# Altium schematic sheet MOTORS ENCODERS.SchDoc: MOTORS & ENCODERS
size 558 x 401 mm; Organization: Carnegie Institution of Washington; DocumentNumber: 6; SheetNumber: 5; SheetTotal: 7; PageSetup: Record=PageOptions|CenterHorizontal=True|CenterVertical=True|PrintScale=0.47|XCorrection=1.00|YCorrection=1.00|PrintKind=0|BorderSize=5000000|LeftOffset=0|BottomOffset=0|Orientation=2|PaperLength=1000|PaperWidth=1000|Scale=100|PaperSource=259|PrintQuality=600|MediaType=1|DitherType=10|PaperKind=11 x 17|PrintScaleMode=1
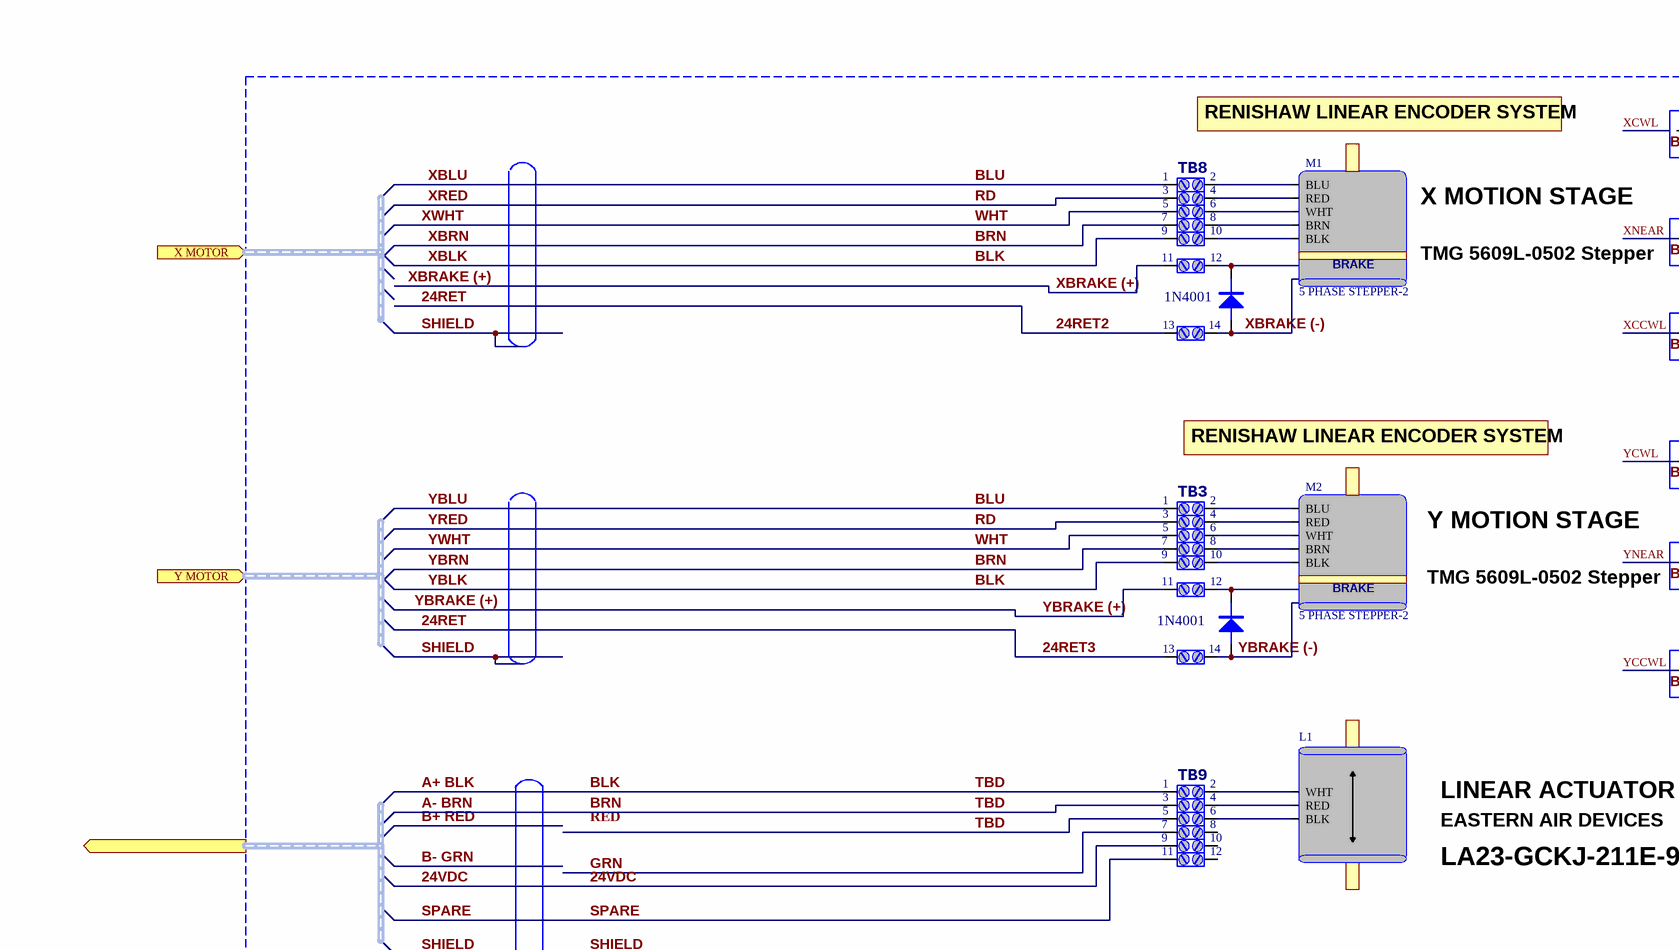
[diagram p0: MOTORS ENCODERS.SchDoc, top left]
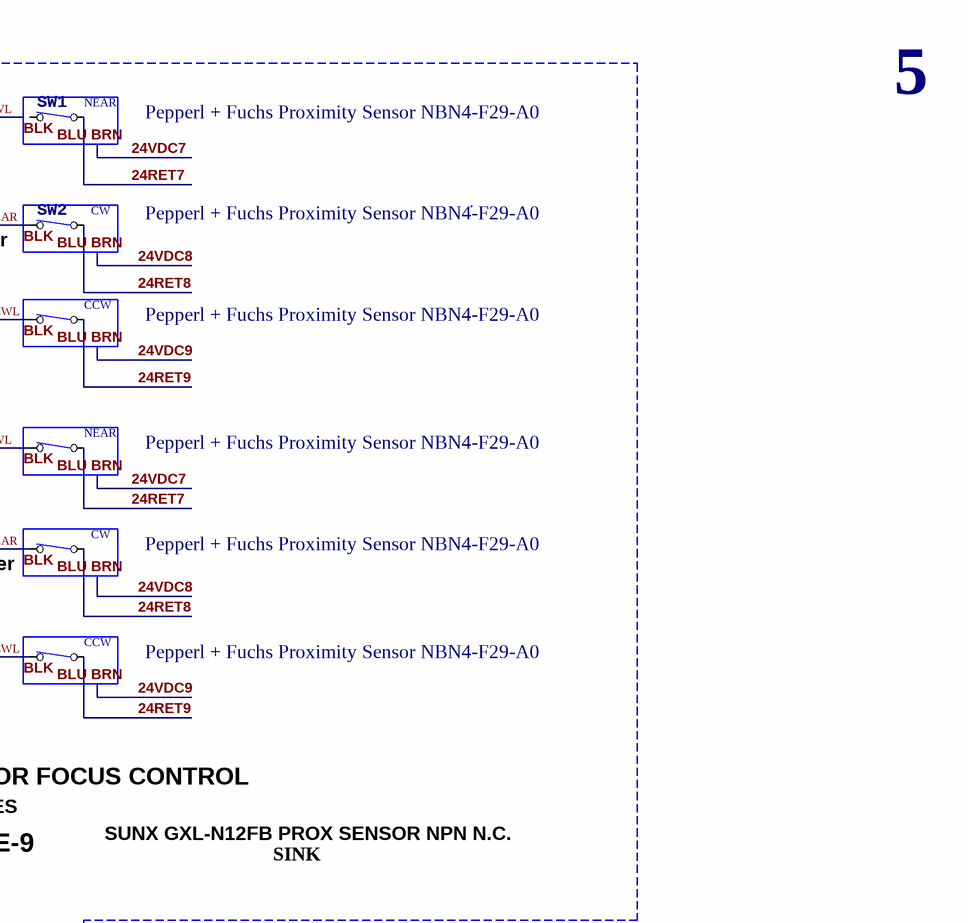
[diagram p1: MOTORS ENCODERS.SchDoc, top right]
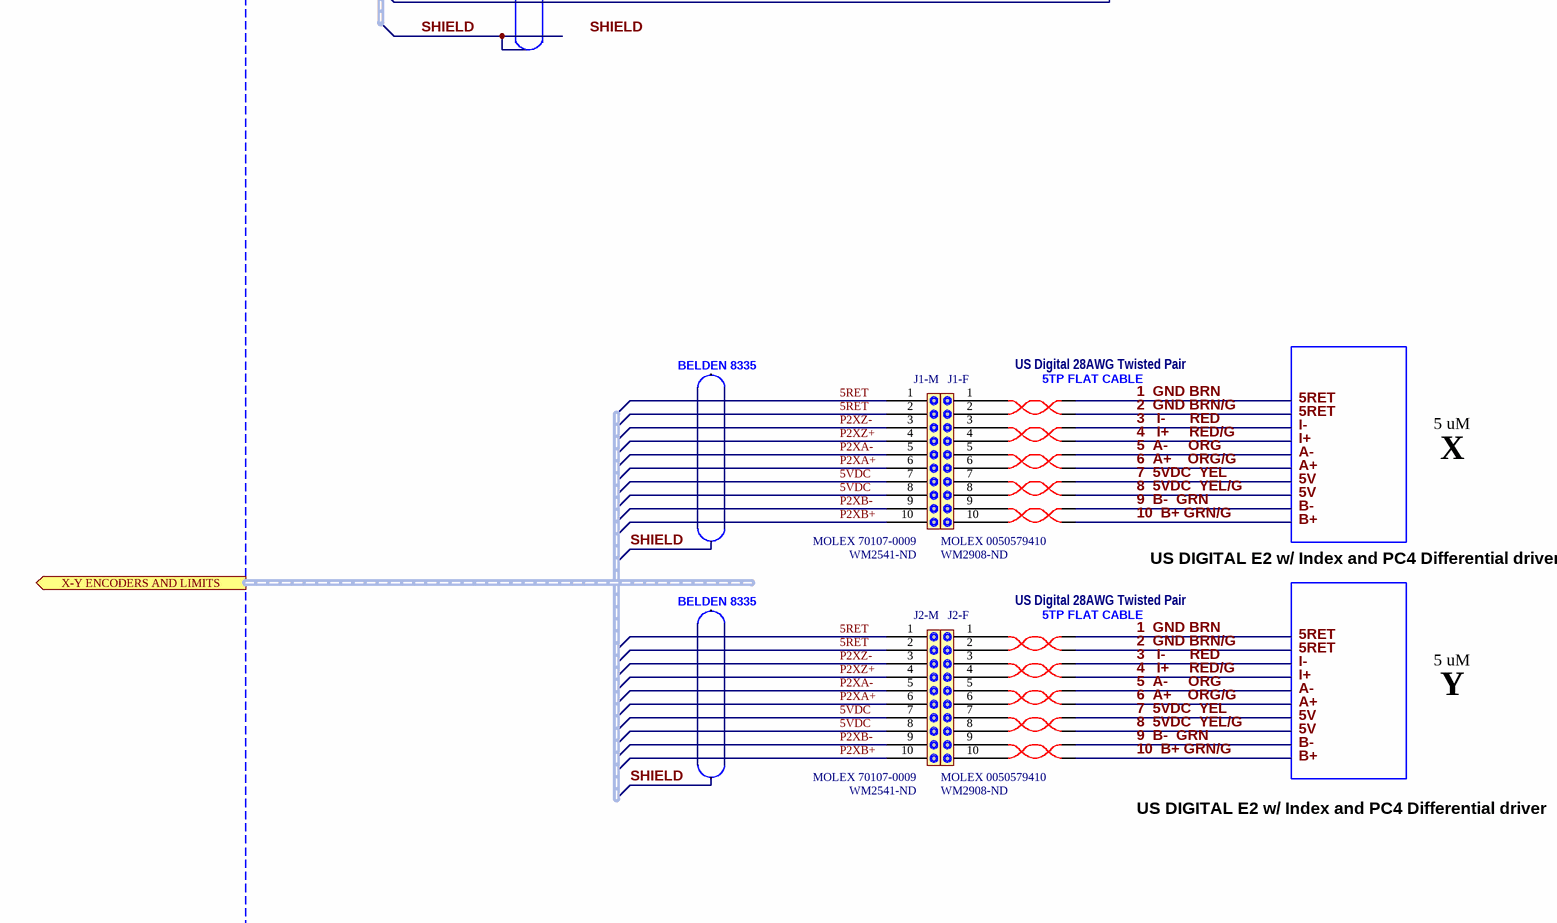
[diagram p2: MOTORS ENCODERS.SchDoc, bottom left]

## Parts
(Parts that share a designator on the sheet are numbered #1, #2 ... from top to bottom, then left to right.)
?#1  Part Field 1: 3  Part Field 2: 4
?#2  Part Field 1: 5  Part Field 2: 6
?#3  Part Field 1: 7  Part Field 2: 8
?#4  Part Field 1: 9  Part Field 2: 10
?#5  Part Field 1: 11  Part Field 2: 12
?#6  (no value)
?#7  Part Field 1: 13  Part Field 2: 14
?#8  (no value)
?#9  (no value)
?#10  Part Field 1: 3  Part Field 2: 4
?#11  Part Field 1: 5  Part Field 2: 6
?#12  Part Field 1: 7  Part Field 2: 8
?#13  Part Field 1: 9  Part Field 2: 10
?#14  (no value)
?#15  Part Field 1: 11  Part Field 2: 12
?#16  (no value)
?#17  Part Field 1: 13  Part Field 2: 14
?#18  (no value)
?#19  Part Field 1: 3  Part Field 2: 4
?#20  Part Field 1: 5  Part Field 2: 6
?#21  Part Field 1: 7  Part Field 2: 8
?#22  Part Field 1: 9  Part Field 2: 10
?#23  Part Field 1: 11  Part Field 2: 12
?#24  (no value)
?#25  TP1  (value not drawn)
?#26  TP1  (value not drawn)
?#27  TP1  (value not drawn)
?#28  TP1  (value not drawn)
?#29  TP1  (value not drawn)
?#30  (no value)
?#31  (no value)
?#32  TP1  (value not drawn)
?#33  TP1  (value not drawn)
?#34  TP1  (value not drawn)
?#35  TP1  (value not drawn)
?#36  TP1  (value not drawn)
?#37  (no value)
J1-F  MOLEX 0050579410  Digikey: WM2908-ND
J1-M  MOLEX 70107-0009  Digikey: WM2541-ND
J2-F  MOLEX 0050579410  Digikey: WM2908-ND
J2-M  MOLEX 70107-0009  Digikey: WM2541-ND
L1  LINEAR MOTOR  (value not drawn)
M1  5 PHASE STEPPER-2
M2  5 PHASE STEPPER-2
SW1  (no value)
SW2  (no value)
TB3  Part Field 1: 1  Part Field 2: 2
TB8  Part Field 1: 1  Part Field 2: 2
TB9  Part Field 1: 1  Part Field 2: 2

## Blocks framed on the sheet
NEAR: SW1
CW: SW2
CCW: ?#8
NEAR: ?#9
CW: ?#14
CCW: ?#18

## Ports
X MOTOR, X-Y ENCODERS AND LIMITS, Y MOTOR, 

## Nets
1  GND BRN: ?#25.18 ?#32.18
2  GND BRN/G: ?#25.17 ?#32.17
3   I-      RED: ?#26.18 ?#33.18
4   I+     RED/G: ?#26.17 ?#33.17
5  A-     ORG: ?#27.18 ?#34.18
5RET: J1-M.1 J1-M.2 J2-M.1 J2-M.2
5VDC: J1-M.7 J1-M.8 J2-M.7 J2-M.8
6  A+    ORG/G: ?#27.17 ?#34.17
7  5VDC  YEL : ?#28.18 ?#35.18
8  5VDC  YEL/G : ?#28.17 ?#35.17
9  B-  GRN: ?#29.18 ?#36.18
10  B+ GRN/G: ?#29.17 ?#36.17
24RET: ?#7.2 ?#17.2  [also labelled 24RET2, 24RET3]
24RET7: ?#9.1 SW1.1
24RET8: ?#14.1 SW2.1
24RET9: ?#8.1 ?#18.1
24VDC: ?#22.2
A+ BLK: ?#3.2 ?#4.2 ?#12.2 ?#13.2 ?#19.2 ?#20.2 TB9.2  [also labelled A- BRN, BLK, BRN, TBD, XBLK, XBRN, YBLK, YBRN]
BLU: TB3.2 TB8.2  [also labelled XBLU, YBLU]
GRN: ?#21.2
P2XA+: J1-M.6 J2-M.6
P2XA-: J1-M.5 J2-M.5
P2XB+: J1-M.10 J2-M.10
P2XB-: J1-M.9 J2-M.9
P2XZ+: J1-M.4 J2-M.4
P2XZ-: J1-M.3 J2-M.3
RD: ?#1.2 ?#10.2  [also labelled XRED, YRED]
SHIELD: ?#30.29(SENCE_HI) ?#37.29(SENCE_HI)
SPARE: ?#23.2
WHT: ?#2.2 ?#11.2  [also labelled XWHT, YWHT]
XBRAKE (+): ?#5.2
XBRAKE (-): ?#6.A ?#7.1
XCCWL: ?#8.2
XNEAR: SW2.2
YBRAKE (+): ?#15.2
YBRAKE (-): ?#16.A ?#17.1
YCCWL: ?#18.2
YCWL: ?#9.2
YNEAR: ?#14.2
Net?#1_1: ?#1.1 M1.?2(RED)
Net?#2_1: ?#2.1 M1.?3(WHT)
Net?#3_1: ?#3.1 M1.?4(BRN)
Net?#4_1: ?#4.1 M1.?5(BLK)
Net?#5_1: ?#5.1 ?#6.K
Net?#10_1: ?#10.1 M2.?2(RED)
Net?#11_1: ?#11.1 M2.?3(WHT)
Net?#12_1: ?#12.1 M2.?4(BRN)
Net?#13_1: ?#13.1 M2.?5(BLK)
Net?#15_1: ?#15.1 ?#16.K
Net?#19_1: ?#19.1 L1.?1(RED)
Net?#20_1: ?#20.1 L1.?3(BLK)
Net?#25_15: ?#25.15 J1-F.1
Net?#25_16: ?#25.16 J1-F.2
Net?#26_15: ?#26.15 J1-F.3
Net?#26_16: ?#26.16 J1-F.4
Net?#27_15: ?#27.15 J1-F.5
Net?#27_16: ?#27.16 J1-F.6
Net?#28_15: ?#28.15 J1-F.7
Net?#28_16: ?#28.16 J1-F.8
Net?#29_15: ?#29.15 J1-F.9
Net?#29_16: ?#29.16 J1-F.10
Net?#32_15: ?#32.15 J2-F.1
Net?#32_16: ?#32.16 J2-F.2
Net?#33_15: ?#33.15 J2-F.3
Net?#33_16: ?#33.16 J2-F.4
Net?#34_15: ?#34.15 J2-F.5
Net?#34_16: ?#34.16 J2-F.6
Net?#35_15: ?#35.15 J2-F.7
Net?#35_16: ?#35.16 J2-F.8
Net?#36_15: ?#36.15 J2-F.9
Net?#36_16: ?#36.16 J2-F.10
NetL1_?2: L1.?2(WHT) TB9.1
NetM1_?1: M1.?1(BLU) TB8.1
NetM2_?1: M2.?1(BLU) TB3.1

Not connected (* = marked no-connect by the designer): ?#21 1; ?#22 1; ?#23 1; ?#24 29(SENCE_HI); ?#31 29(SENCE_HI); SW1 2

## Notes on the sheet
- RENISHAW LINEAR ENCODER SYSTEM
- Pepperl + Fuchs Proximity Sensor NBN4-F29-A0
- 5
- (near M1) BRAKE
- TMG 5609L-0502 Stepper
- X MOTION STAGE
- 1N4001
- Y MOTION STAGE
- (near M2) BRAKE
- LINEAR ACTUATOR FOCUS CONTROL
- LA23-GCKJ-211E-9
- EASTERN AIR DEVICES
- SUNX GXL-N12FB PROX SENSOR NPN N.C.
- SINK
- BELDEN 8335
- US Digital 28AWG Twisted Pair
- 5TP FLAT CABLE
- 5 uM
- X
- US DIGITAL E2 w/ Index and PC4 Differential driver
- Y
- Labels drawn without touching a wire or pin: 5RET, 5V, A+, A-, B+, B-, BLK, BLU, BRN, I+, I-, RED, SHIELD
- Carnegie Institution of Washington
- 813 Santa Barbara Street
- The Observatories
- PHONE (626) 577-1122               FAX (626) 795-8136
- Pasadena, California 91101
- Title:
- OCIW
- Size:
- Date:
- C
- Scale:
- Drawn By:
- Checked By:
- A. BAGISH
- alanb
- Revision:
- Sheet          of
- File:

## Library data of the parts
?#1-?#5 ?#7 ?#10-?#13 ?#15 ?#17 ?#19-?#23 TB3 TB8 TB9 = TB3
?#6 ?#16 = DIODE
?#8 ?#9 ?#14 ?#18 SW1 SW2 = SW-NC2
?#24 ?#30 ?#31 ?#37 = ARC
J1-F J1-M J2-F J2-M = TP10